# EAGLE design Gator_rtc (EAGLE 9.1.0)
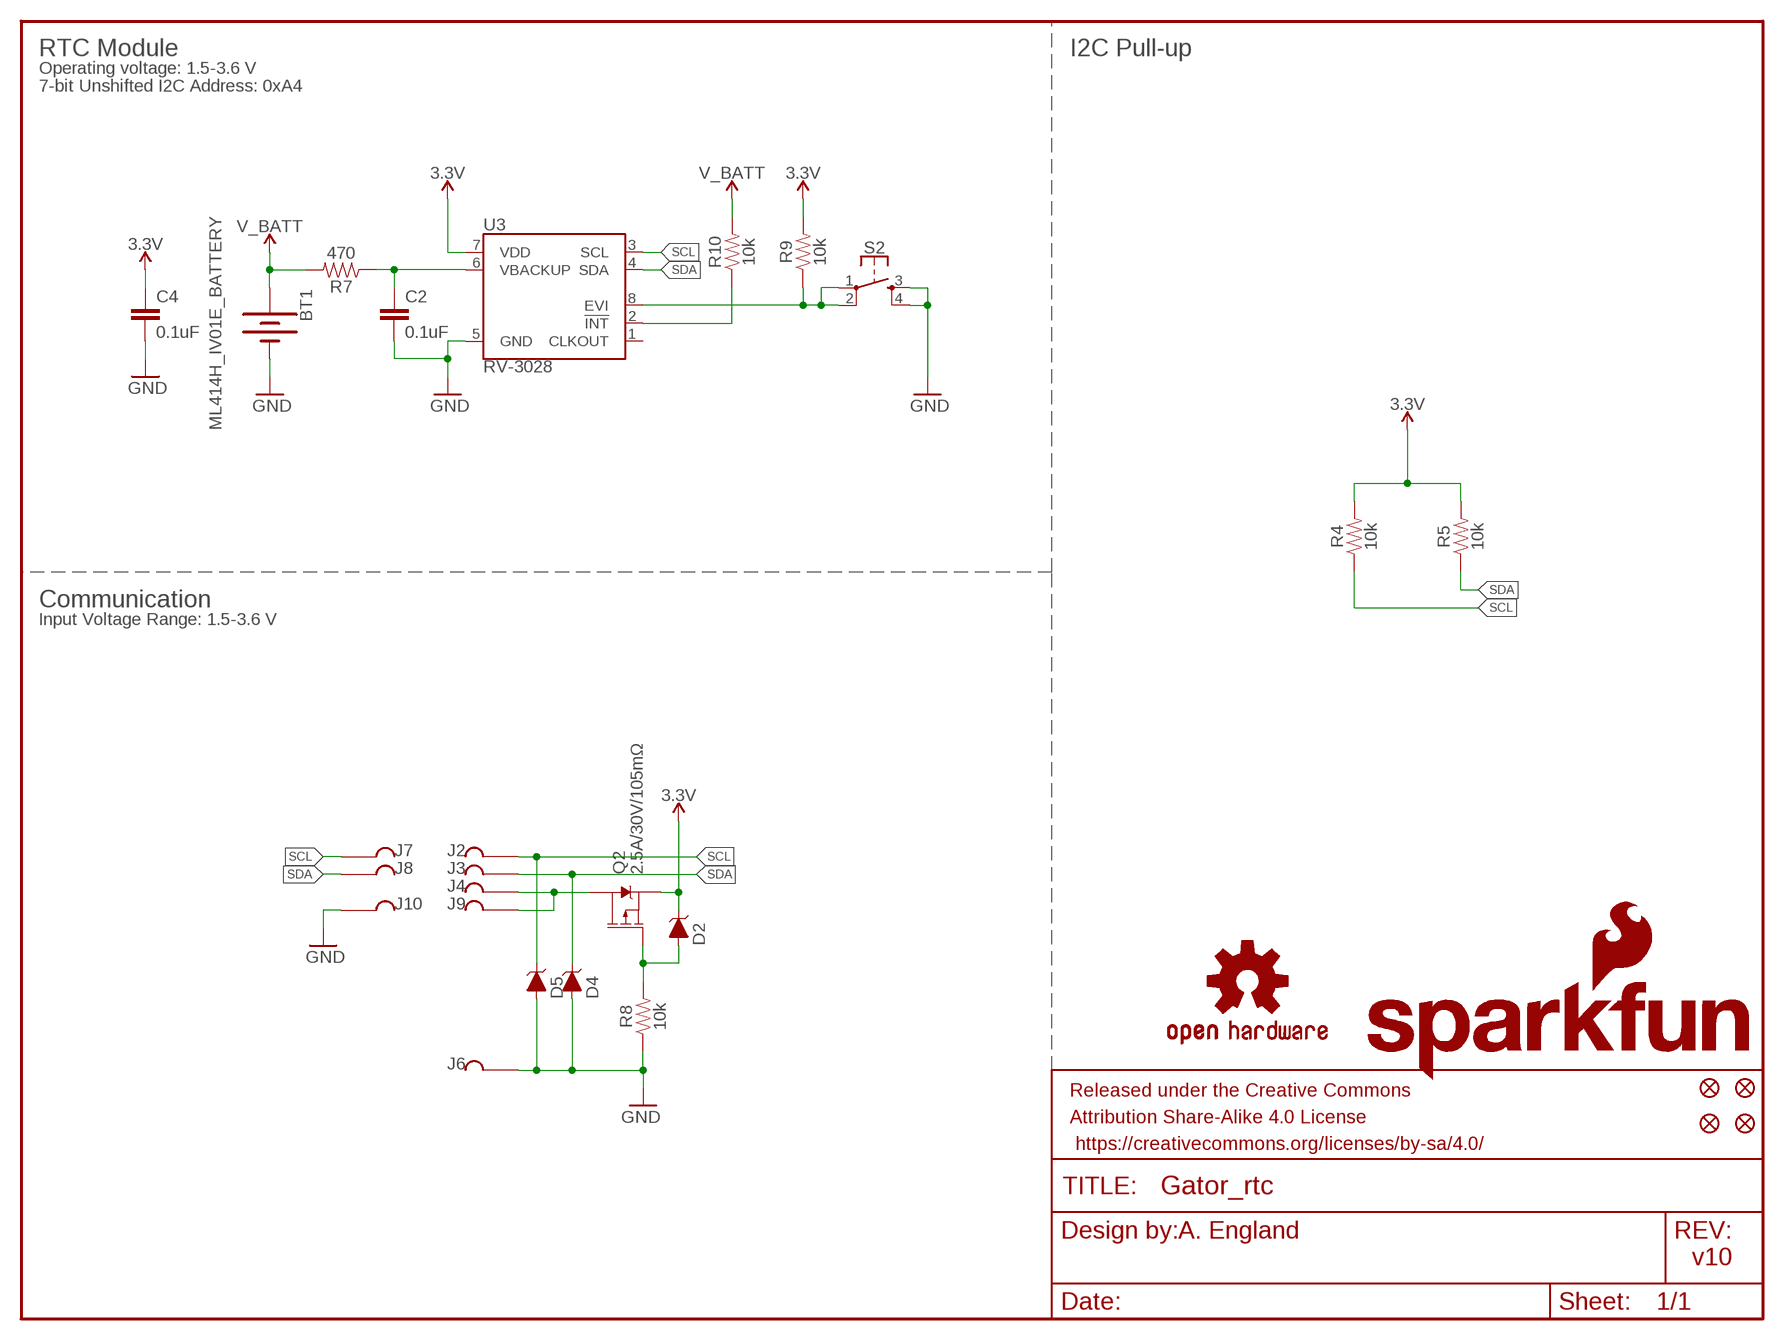
[diagram p0: schematic, sheet 1]

## Parts
BT1  ML414H_IV01E_BATTERY  [ML414H_IV01E]
C2  0.1uF  0.1UF-0603-25V-(+80/-20%)  [0603]
C4  0.1uF  0.1UF-0603-25V-(+80/-20%)  [0603]
D2  3.6V  DIODE-ZENER-BZT52C3V6S  [SOD-323]
D4  3.6V  DIODE-ZENER-BZT52C3V6S  [SOD-323]
D5  3.6V  DIODE-ZENER-BZT52C3V6S  [SOD-323]
FID1  FIDUCIALUFIDUCIAL  [FIDUCIAL-MICRO]
FID2  FIDUCIALUFIDUCIAL  [FIDUCIAL-MICRO]
FID3  FIDUCIALUFIDUCIAL  [FIDUCIAL-MICRO]
FID4  FIDUCIALUFIDUCIAL  [FIDUCIAL-MICRO]
FRAME1  FRAME-LETTER  [CREATIVE_COMMONS]
J2  GATORGATOR_MINI  [GATOR_MINI]
J3  GATORGATOR_MINI  [GATOR_MINI]
J4  GATORGATOR_MINI  [GATOR_MINI]
J6  GATORGATOR_MINI  [GATOR_MINI]
J7  GATORGATOR_MINI  [GATOR_MINI]
J8  GATORGATOR_MINI  [GATOR_MINI]
J9  GATORGATOR_MINI  [GATOR_MINI]
J10  GATORGATOR_MINI  [GATOR_MINI]
LOGO2  OSHW-LOGOMINI  [OSHW-LOGO-MINI]
LOGO4  SFE_LOGO_NAME_FLAME.1_INCH  [SFE_LOGO_NAME_FLAME_.1]
Q2  2.5A/30V/105mΩ  MOSFET_PCH-DMG2307L  [SOT23-3]
R4  10k  10KOHM-0603-1/10W-1%  [0603]
R5  10k  10KOHM-0603-1/10W-1%  [0603]
R7  470  470OHM-0603-1/10W-1%  [0603]
R8  10k  10KOHM-0603-1/10W-1%  [0603]
R9  10k  10KOHM-0603-1/10W-1%  [0603]
R10  10k  10KOHM-0603-1/10W-1%  [0603]
S2  MOMENTARY-SWITCH-SPST-2-SMD-5.2MM-TALL  [TACTILE_SWITCH_SMD_5.2MM]
U3  RV-3028  [RV-3028]

## Nets
3.3V: C4.1 D2.C Q2.2(S) R4.2 R5.2 R9.2 U3.7(VDD)
!RST: R10.1 U3.2(!INT)
GND [vcc]: BT1.- C2.2 C4.2 D4.A D5.A J6.P$2 J10.P$2 R8.1 S2.3 S2.4 U3.5(GND)
N$5: J4.P$2 J9.P$2 Q2.3(D)
N$6: D2.A Q2.1(G) R8.2
N$8: R9.1 S2.1 S2.2 U3.8(EVI)
SCL: D5.C J2.P$2 J7.P$2 R4.1 U3.3(SCL)
SDA: D4.C J3.P$2 J8.P$2 R5.1 U3.4(SDA)
V_BATT: BT1.+ R7.2 R10.2
VBACKUP: C2.1 R7.1 U3.6(VBACKUP)
Unconnected: U3.1(CLKOUT)

## Notes on the sheet
- RTC Module | I2C Pull-up
- Operating voltage: 1.5-3.6 V
- 7-bit Unshifted I2C Address: 0xA4
- Communication
- Input Voltage Range: 1.5-3.6 V
- A. England
- v10

## Library data of the parts
BT1 = SparkFun-Batteries:ML414H_IV01E_BATTERY: SEIKO ML414H-IV01E Reflowable Lithium Battery ML414H is a rechargeable, coin type battery with features such as Pb-free reflowable (Peak temperature: 260 C) and high temperature heat resistance. Battery Characteristics: 3.1V max voltage Voff is 2V 1mAH 3k series resistor with battery 72 hour charge time from 2.0-3.1V 2.3-2.8V initial charge; PROD_ID: BATT-14267
C2 C4 = SparkFun-Capacitors:0.1UF: 0.1µF ceramic capacitors A capacitor is a passive two-terminal electrical component used to store electrical energy temporarily in an electric field.; PROD_ID: CAP-00810
D2 D4 D5 = SparkFun-DiscreteSemi:DIODE-ZENER: Zener Diode A Zener diode allows current to flow from its anode to its cathode like a normal semiconductor diode, but it also permits current to flow in the reverse direction when its "Zener voltage" is reached. - WIkipedia; PROD_ID: DIO-08199
FID1-FID4 = SparkFun-Aesthetics:FIDUCIAL: Fiducial Alignment Points Point-of-reference for pick-and-place machines and other optical instruments.
FRAME1 = SparkFun-Aesthetics:FRAME-LETTER: Schematic Frame - Letter Standard 8.5x11 US Letter frame
J2-J4 J6-J10 = SparkFun-Connectors:GATOR
LOGO2 = SparkFun-Aesthetics:OSHW-LOGO: Open-Source Hardware (OSHW) Logo This logo indicates the piece of hardware it is found on incorporates a OSHW license and/or adheres to the definition of open source hardware found here: http://freedomdefined.org/OSHW
LOGO4 = SparkFun-Aesthetics:SFE_LOGO_NAME_FLAME: SparkFun Font Logo w/ Flame This is the SparkFun full logo. The logo on the schematic will always be the same size; the package variant is the height of the flame part of the logo. Default layer for the logo on the board is tSilk.
Q2 = SparkFun-DiscreteSemi:MOSFET_PCH: P-channel MOSFETs Voltage controlled devices that allow control of high current outputs. SparkFun Products: SparkFun ESP32 Thing <https://www.sparkfun.com/products/13907> SparkFun ESP8266 Thing <https://www.sparkfun.com/products/13231>; PROD_ID: TRANS-11308
R4 R5 R8-R10 = SparkFun-Resistors:10KOHM: 10kΩ resistor A resistor is a passive two-terminal electrical component that implements electrical resistance as a circuit element. Resistors act to reduce current flow, and, at the same time, act to lower voltage levels within circuits. - Wikipedia; PROD_ID: RES-00824
R7 = SparkFun-Resistors:470OHM: 470Ω resistor A resistor is a passive two-terminal electrical component that implements electrical resistance as a circuit element. Resistors act to reduce current flow, and, at the same time, act to lower voltage levels within circuits. - Wikipedia; PROD_ID: RES-07869
S2 = SparkFun-Switches:MOMENTARY-SWITCH-SPST-2: Momentary Switch (Pushbutton) - SPST - Two Circuits Normally-open (NO) SPST momentary switches (buttons, pushbuttons). Schematic symbol includes two switch circuits. Variants SMD-4.6MMX2.8MM - 4.60mm x 2.80mm Tactile Momentary Button Switch - Used on SparkFun SAMD21 Mini Breakout <https://www.sparkfun.com/products/13664> SMD-5.2MM - Mini Pushbutton Switch - SMD <https://www.sparkfun.com/products/8720> - Used on Arduino Pro Mini <https://www.sparkfun.com/products/11114>; PROD_ID: SWCH-14139
U3 = SparkFun-Clocks:RV-3028: RV-3028 - RTC with I2C Bus Specifications: Pin count: 8 Pin pitch: .9mm Area: [3.2mm x 2.0mm] Datasheet referenced for footprint <https://www.microcrystal.com/fileadmin/Media/Products/RTC/App.Manual/RV-3028-C7_App-Manual.pdf>; PROD_ID: IC-14378

## Net classes
1 vcc: width 0.152 mm

## Board
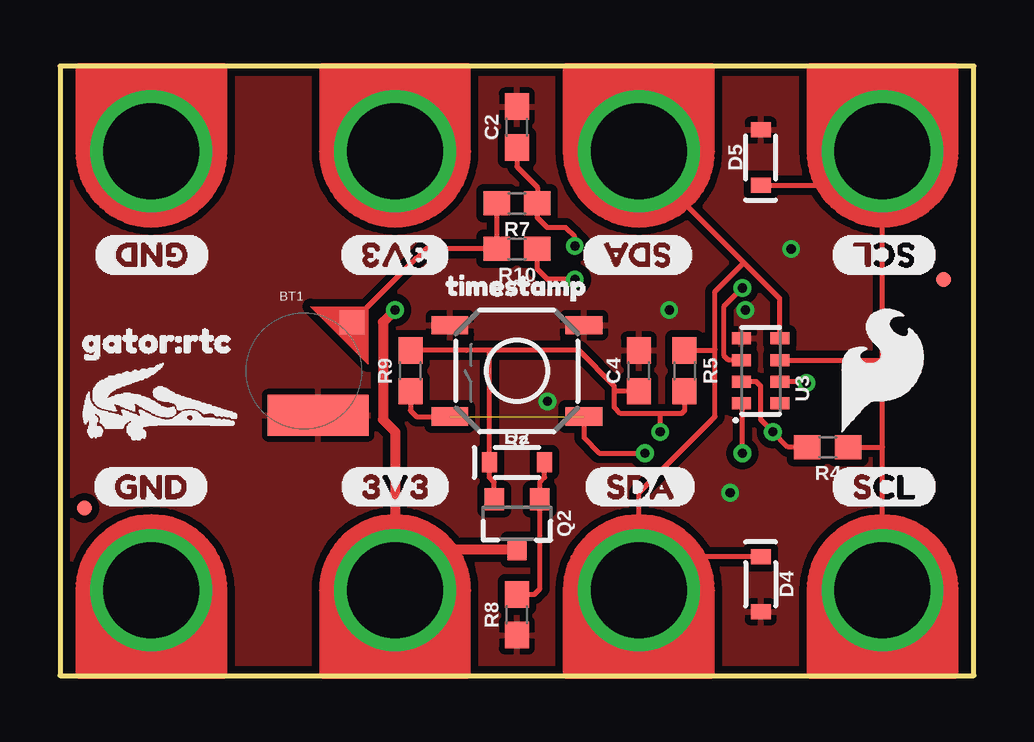
[diagram p1: board, top side]
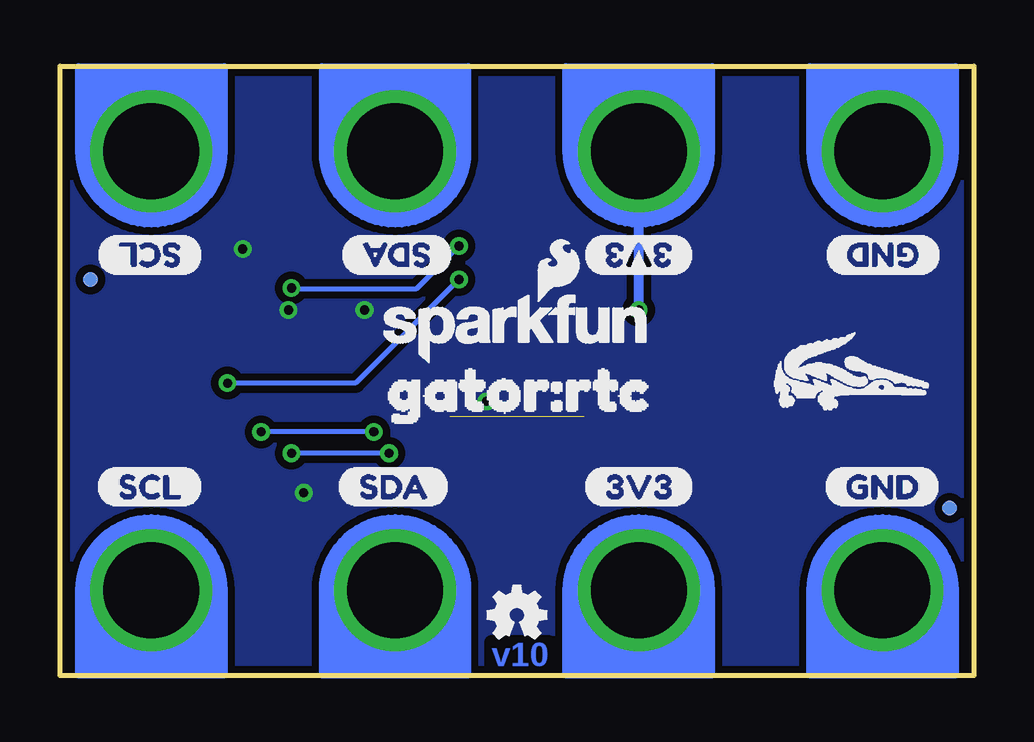
[diagram p2: board, bottom side, seen from below]

Size 38.1 x 25.4 mm. Coordinates in mm from the lower left corner, seen from the top.
Outline: 38.1,0 38.1,25.4 0,25.4 0,0 38.1,0
Copper layers (1*16): Top 0.035mm / dielectric 1.5mm / Bottom 0.035mm
Design rules "SparkFun-2-layer-TIGHT": minimum track width 7mil, minimum drill 15mil, track to track 7mil, track to pad 7mil, pad to pad 7mil, via to via 7mil, smd to smd 7mil, copper to edge 7mil, drill to drill 7mil, minimum pad ring 7mil, minimum via ring 7mil, stop-mask expansion 4mil, vias tented up to drill 25mil, thermal gap 10mil

### Footprints (pad centres in the part's own frame; a part is rotated, then mirrored left to right if it is on the bottom)
ML414H_IV01E = smd 1 x 1: + 2.022,2.032 | smd 4.2 x 1.7: - 0.6,-1.85
0603 = smd 1.1 x 1: 1 -0.85,0; 2 0.85,0
SOD-323 = smd 0.63 x 0.83: A 1.15,0; C -1.15,0
FIDUCIAL-MICRO = smd 0.635 x 0.635: 1 0,0
GATOR_MINI = drill 4 pad 5.08: P$2 0,-0.254
SOT23-3 = smd 0.8 x 0.9: 1 -0.95,-1; 2 0.95,-1; 3 0,1.1
TACTILE_SWITCH_SMD_5.2MM = smd 1.524 x 0.762: 1 -2.794,1.905; 2 2.794,1.905; 3 -2.794,-1.905; 4 2.794,-1.905
RV-3028 = smd 0.5 x 0.8: 1 -1.35,-0.8; 2 -0.45,-0.8; 3 0.45,-0.8; 4 1.35,-0.8; 5 1.35,0.8; 6 0.45,0.8; 7 -0.45,0.8; 8 -1.35,0.8

### Placement (x,y rotation side)
BT1  10.16,12.7 0 top
C2  19.05,22.86 90 top
C4  24.13,12.7 90 top
D2  19.05,8.89 0 top
D4  29.21,3.81 270 top
D5  29.21,21.59 90 top
FID1  36.83,16.51 0 top
FID2  1.02,6.99 0 top
FID3  1.02,6.99 180 bottom
FID4  36.83,16.51 0 bottom
FRAME1  -21.06,-15.24 0 top  (outside the outline)
J2  34.29,21.59 180 top
J3  24.13,21.59 180 top
J4  13.97,21.59 180 top
J6  3.81,21.59 180 top
J7  34.29,3.81 0 top
J8  24.13,3.81 0 top
J9  13.97,3.81 0 top
J10  3.81,3.81 0 top
LOGO2  19.05,2.54 0 bottom
LOGO4  19.05,14.48 0 bottom
Q2  19.05,6.35 180 top
R4  32,9.53 180 top
R5  26.04,12.7 270 top
R7  19.05,19.68 180 top
R8  19.05,2.54 90 top
R9  14.61,12.7 90 top
R10  19.05,17.78 180 top
S2  19.05,12.7 180 top
U3  29.21,12.7 90 top
U$1  [3V33]  11.63,7.87 0 top
U$2  [GND0]  1.37,7.87 0 top
U$3  [3V33]  16.31,17.53 180 top
U$4  [SDA1]  21.84,7.87 0 top
U$5  [SCL2]  32.13,7.87 0 top
U$6  [SCL2]  36.58,17.53 180 top
U$7  [SDA1]  26.42,17.53 180 top
U$8  [GATORBIT_FINAL_FOR_SILK#01#PNG]  5.08,12.7 0 bottom
U$9  [SFE_LOGO_FLAME_.2]  34.29,12.7 0 top
U$10  [GND0]  6.25,17.53 180 top
U$11  [GND0]  1.37,17.53 180 bottom
U$12  [3V33]  11.63,17.53 180 bottom
U$13  [SDA1]  21.72,17.53 180 bottom
U$14  [SCL2]  32.13,17.53 180 bottom
U$15  [3V33]  16.31,7.87 0 bottom
U$16  [SDA1]  26.54,7.87 0 bottom
U$17  [TIMESTAMP0]  15.37,16.26 0 top
U$18  [SCL2]  36.58,7.87 0 bottom
U$20  [GATOR#RTC0]  0,13.97 0 top
U$21  [GATORBIT_FINAL_FOR_SILK#01#PNG]  4.19,11.43 0 top
U$22  [ORDERING_INSTRUCTIONS]  -10.16,-24.13 0 top  (outside the outline)
U$23  [GND0]  6.25,7.87 0 bottom
U$24  [GATOR#RTC0]  26.04,11.94 0 bottom

### Tracks (layer width: path | path; a pad name or v marks a point on that pad's centre or on a via)
3.3V  (via drill 0.38)
  Top 0.203: R4.2 30.35,9.53 v29.72,10.16 29.21,10.67 29.21,12.06 29.02,12.25 U3.7 | Q2.2 18.1,8.06 17.9,8.26 D2.C 17.9,13.54 17.91,13.55 | R9.2 16.93,13.55 17.91,13.55 | R5.2 26.04,11.05 25.91,10.92 25.4,10.92 25.02,10.92 | 23.11,11.81 23.11,11.18 23.37,10.92 25.02,10.92 | 23.11,11.81 23.11,12.06 21.63,13.55 17.91,13.55 | C4.1 23.15,11.85 23.11,11.81 | 25.02,10.92 v25.02,10.16
  Bottom 0.203: v25.02,10.16 v29.72,10.16
!RST  (via drill 0.38)
  Top 0.203: v31.11,12.19 31.06,12.25 U3.2 | v21.46,16.51 20.32,16.51 19.9,16.93 R10.1
  Bottom 0.203: v21.46,16.51 25.78,12.19 v31.11,12.19
GND  (via drill 0.38)
  other vias: 30.48,17.78 28.57,15.24 25.4,15.24 20.32,11.43 27.94,7.62
  pour Top (isolate 0.305): 38.1,0 0,0 0,25.4 38.1,25.4
  pour Bottom (isolate 0.305): 38.1,0 0,0 0,25.4 38.1,25.4
N$5  (via drill 0.38)
  Top 0.406: J9.P$2 13.84,3.68 13.97,3.81 13.97,6.35 | v13.97,15.24 13.46,14.73 13.46,10.67 13.97,10.16 13.97,6.35 | Q2.3 15.07,5.25 13.97,6.35
  Bottom 0.406: v13.97,15.24 J4.P$2
N$6
  Top 0.203: Q2.1 20,7.62 | 20,7.62 20,8.06 20.2,8.26 D2.A | R8.2 19.77,3.39 20,3.62 20,7.62
N$8  (via drill 0.38)  (1 unrouted)
  Top 0.203: R9.1 14.61,11.05 14.86,10.79 S2.2 | S2.1 21.84,9.91 22.48,9.27 v24.38,9.27 | v28.45,9.27 28.45,11.31 U3.8
  Bottom 0.203: v24.38,9.27 v28.45,9.27
SCL
  Top 0.203: J2.P$2 34.29,20.32 | 34.29,13.08 34.29,20.32 | D5.C 34.17,20.44 34.29,20.32 | U3.3 34.22,13.15 34.29,13.08 | J7.P$2 34.29,9.53 | 34.29,9.53 34.29,13.08 | R4.1 34.29,9.53
SDA
  Top 0.203: J3.P$2 24.13,21.59 28.51,17.21 | D4.C 24.25,4.96 24.13,5.08 J8.P$2 24.13,7.62 27.3,10.79 27.3,13.59 | 28.51,17.21 30.01,15.71 U3.4 | 28.51,17.21 27.3,16 27.3,13.59 | R5.1 27.27,13.55 27.3,13.59
V_BATT
  Top 0.203: R10.2 | BT1.+ 14.85,17.4 14.86,17.4 15.24,17.78 R10.2 | R7.2 R10.2
VBACKUP  (via drill 0.38)
  Top 0.203: U3.6 27.87,13.15 27.69,13.34 27.69,15.39 v28.45,16.15 | v21.46,17.91 21.46,18.29 21.08,18.67 20.32,18.67 20.13,18.86 | 20.13,18.86 19.9,19.09 | C2.1 19.05,21.21 19.9,20.36 R7.1 19.9,19.09 | 20.13,18.86 19.9,19.09
  Bottom 0.203: v28.45,16.15 28.45,16.13 23.24,16.13 v21.46,17.91

### Text on the board
Bottom: v10
tValues: Qwiic | Qwiic
Measures: Units in Inches
tDocu: A. England | Black Gloss Soldermask